# EasyEDA schematic schematic.json
TITLE: Sheet_1; REV: 1.0; Date: 2024-11-03; Sheet: 1/1; Drawn By: ysingh2026; Company: Your Company
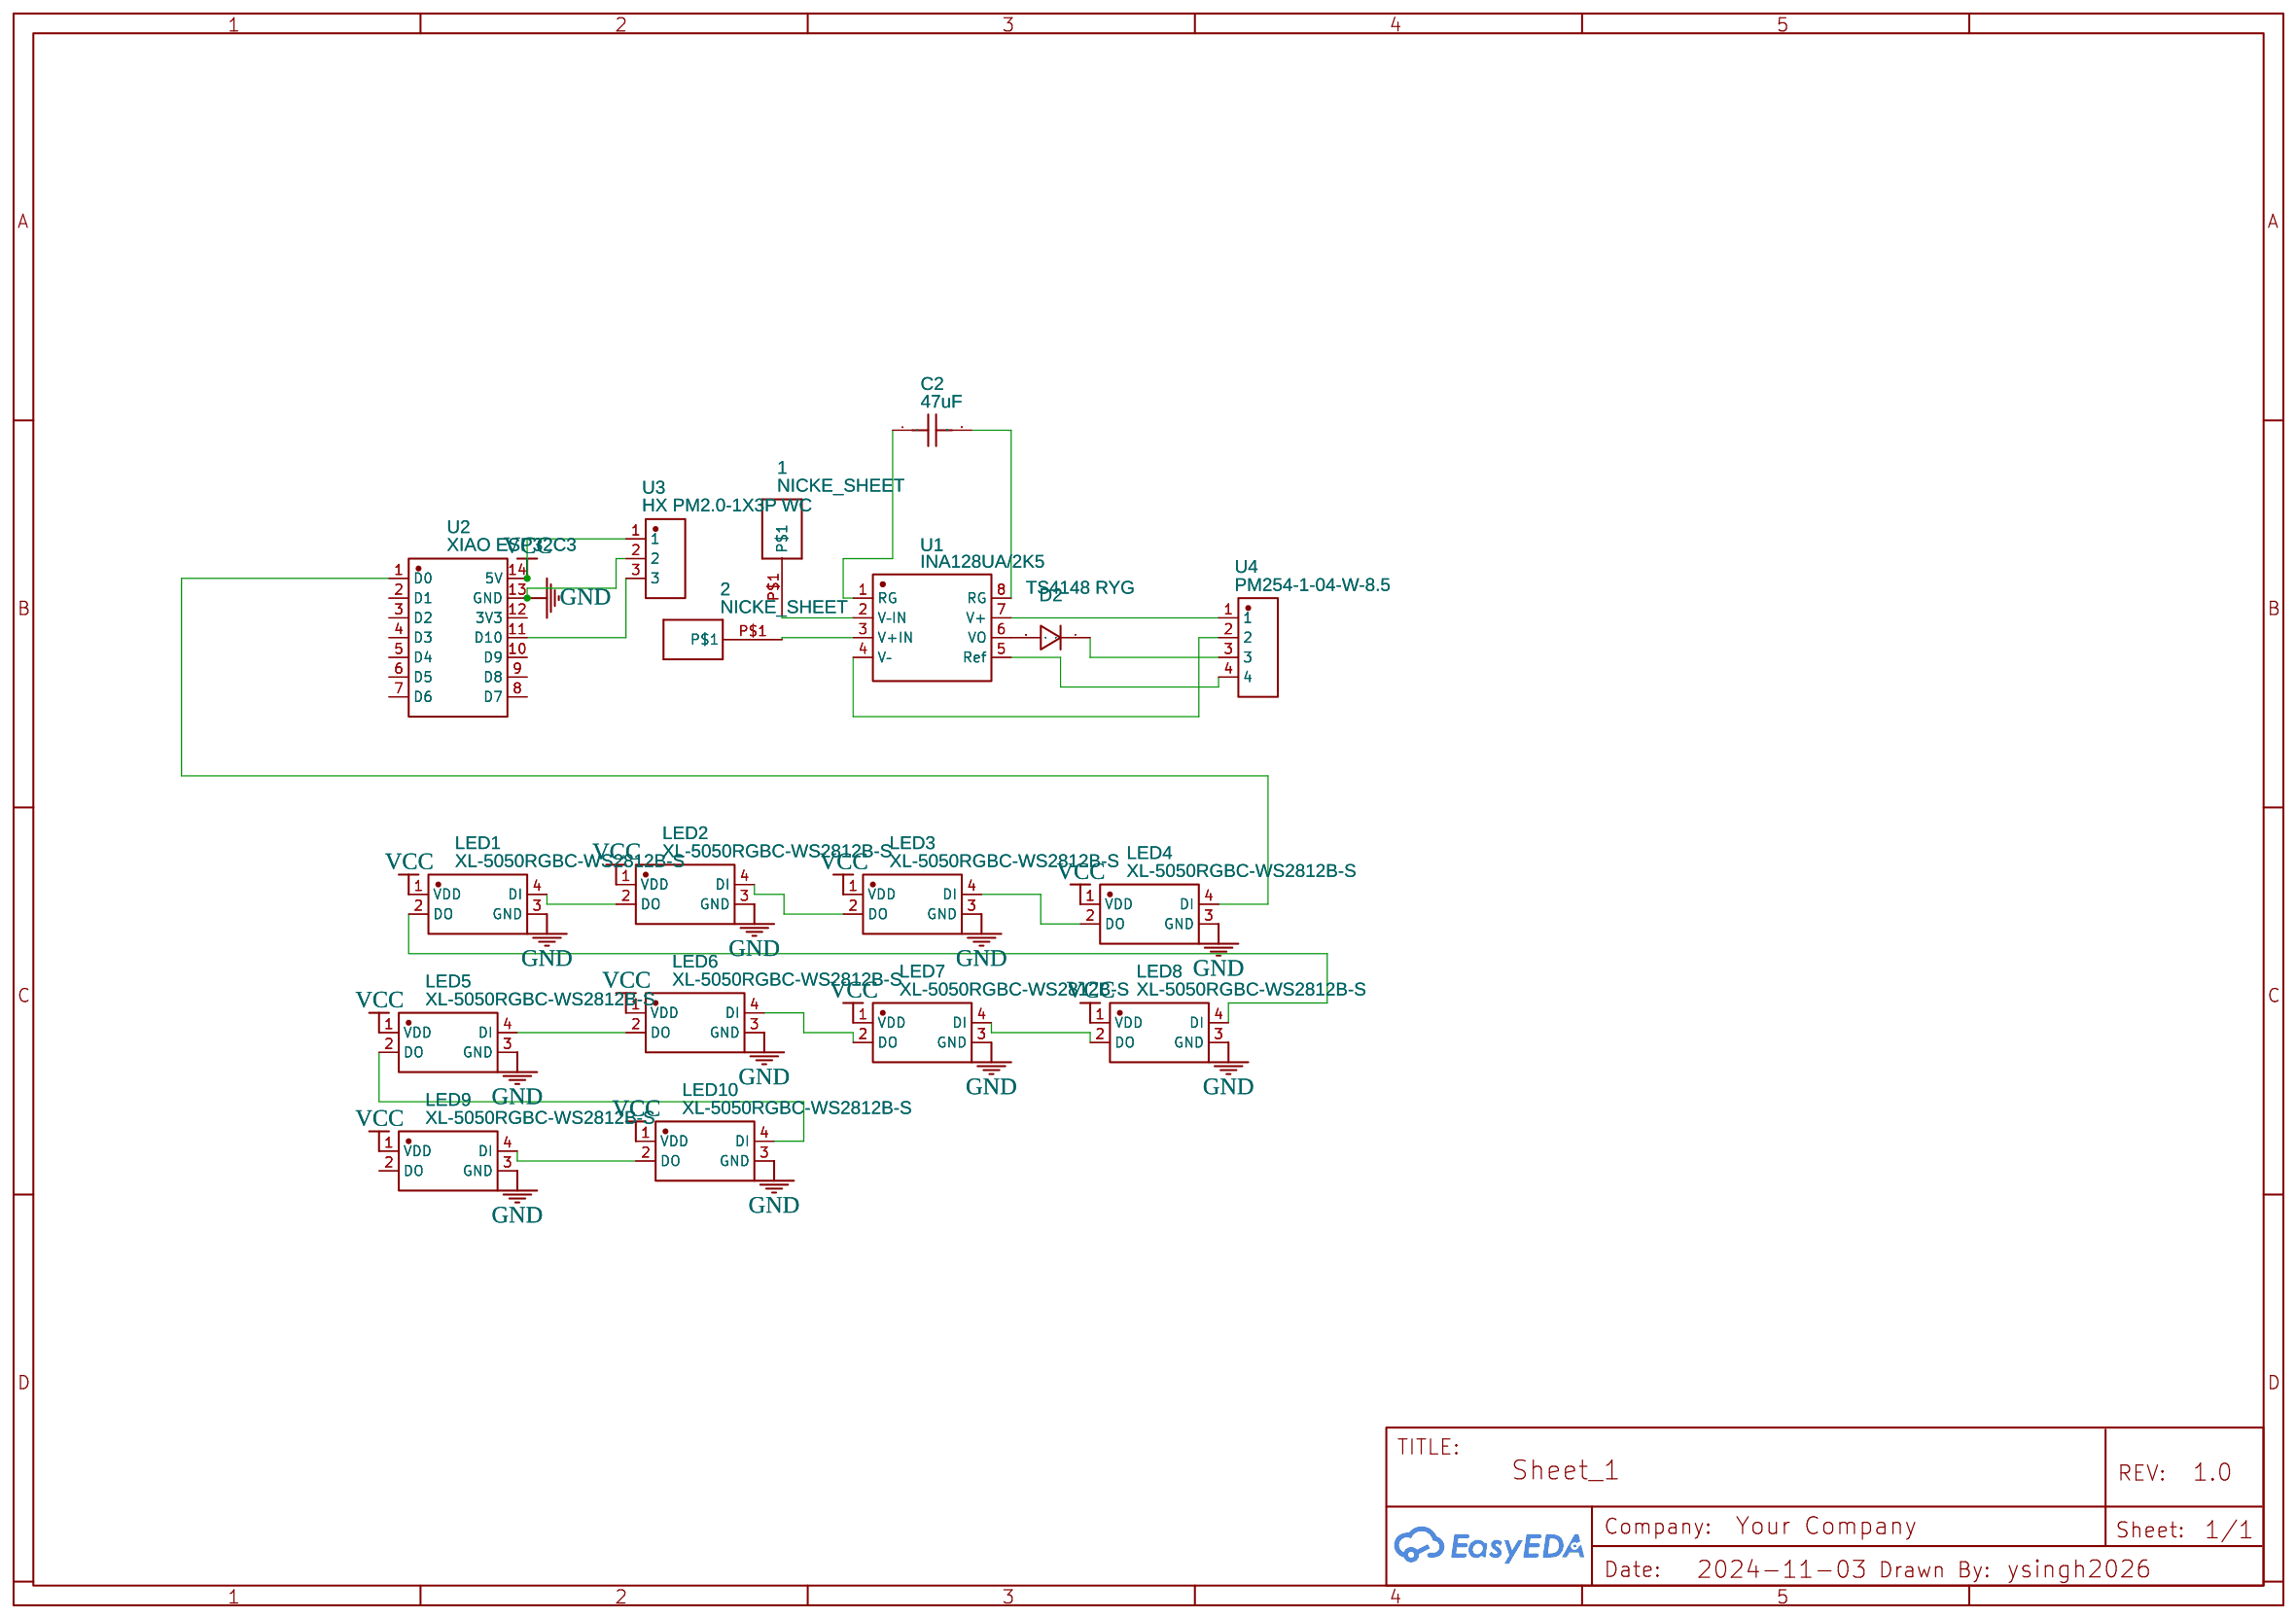
[diagram p0: schematic sheet]

## Parts
1  NICKE_SHEET  [NICKEL_SHEET]
2  NICKE_SHEET  [NICKEL_SHEET]
C2  47uF  [C1210]
D2  TS4148 RYG  [D0805-RD]
LED1  XL-5050RGBC-WS2812B-S  [LED-SMD_4P-L5.0-W5.0-TL-1]
LED2  XL-5050RGBC-WS2812B-S  [LED-SMD_4P-L5.0-W5.0-TL-1]
LED3  XL-5050RGBC-WS2812B-S  [LED-SMD_4P-L5.0-W5.0-TL-1]
LED4  XL-5050RGBC-WS2812B-S  [LED-SMD_4P-L5.0-W5.0-TL-1]
LED5  XL-5050RGBC-WS2812B-S  [LED-SMD_4P-L5.0-W5.0-TL-1]
LED6  XL-5050RGBC-WS2812B-S  [LED-SMD_4P-L5.0-W5.0-TL-1]
LED7  XL-5050RGBC-WS2812B-S  [LED-SMD_4P-L5.0-W5.0-TL-1]
LED8  XL-5050RGBC-WS2812B-S  [LED-SMD_4P-L5.0-W5.0-TL-1]
LED9  XL-5050RGBC-WS2812B-S  [LED-SMD_4P-L5.0-W5.0-TL-1]
LED10  XL-5050RGBC-WS2812B-S  [LED-SMD_4P-L5.0-W5.0-TL-1]
U1  INA128UA/2K5  [SOIC-8_L4.9-W3.9-P1.27-LS6.0-BL]
U2  XIAO ESP32C3  [COMM-SMD_KQ-2801_V106]
U3  HX PM2.0-1X3P WC  [HDR-TH_3P-P2.00-H-F-W4.8]
U4  PM254-1-04-W-8.5  [HDR-TH_4P-P2.54-H-F-W10.0-N]

## Library data of the parts
1 2 = NICKE_SHEET: Contributor: ahmed elqusy
C2 = CS3225X7R476K100NRL: Supplier: LCSC; Supplier Part: C5189825; Manufacturer: SAMWHA(三和); JLCPCB Part Class: Extended Part; Contributor: lcsc
D2 = TS4148 RYG: Supplier: LCSC; Supplier Part: C5341669; Manufacturer: Taiwan Semiconductor(台湾半导体); JLCPCB Part Class: Extended Part; Contributor: lcsc
LED1-LED10 = XL-5050RGBC-WS2812B-S: Supplier: LCSC; Supplier Part: C22461793; Manufacturer: XINGLIGHT(成兴光); Contributor: lcsc; JLCPCB Part Class: Extended Part
U1 = INA128UA/2K5: Supplier: LCSC; Manufacturer: TI(德州仪器); Supplier Part: C22233; JLCPCB Part Class: Extended Part
U2 = XIAO ESP32C3: Supplier: LCSC; Supplier Part: C19189385; Manufacturer: null; JLCPCB Part Class: Extended Part; Contributor: lcsc
U3 = HX PM2.0-1X3P WC: Supplier: LCSC; Supplier Part: C22465677; Manufacturer: hanxia(韩下); Manufacturer Part: HX PM2.0-1x3P WC; JLCPCB Part Class: Extended Part; Contributor: lcsc
U4 = PM254-1-04-W-8.5: Contributor: LCSC; Supplier: LCSC; Supplier Part: C2897386; Manufacturer: HCTL(华灿天禄); JLCPCB Part Class: Extended Part

## Nets
GND: LED1.3(GND) LED2.3(GND) LED3.3(GND) LED4.3(GND) LED5.3(GND) LED6.3(GND) LED7.3(GND) LED8.3(GND) LED9.3(GND) LED10.3(GND) U2.13(GND) U3.2
VCC: LED1.1(VDD) LED2.1(VDD) LED3.1(VDD) LED4.1(VDD) LED5.1(VDD) LED6.1(VDD) LED7.1(VDD) LED8.1(VDD) LED9.1(VDD) LED10.1(VDD) U2.14(5V) U3.1
Net-(1-P$1): 1.P$1 U1.2(V–IN)
Net-(2-P$1): 2.P$1 U1.3(V+IN)
Net-(C2-1): C2.1 U1.1(RG)
Net-(C2-2): C2.2 U1.8(RG)
Net-(D2-1): D2.1 U4.3
Net-(D2-2): D2.2 U1.6(VO)
Net-(LED1-2): LED1.2(DO) LED8.4(DI)
Net-(LED1-4): LED1.4(DI) LED2.2(DO)
Net-(LED2-4): LED2.4(DI) LED3.2(DO)
Net-(LED3-4): LED3.4(DI) LED4.2(DO)
Net-(LED4-4): LED4.4(DI) U2.1(D0)
Net-(LED5-2): LED5.2(DO) LED10.4(DI)
Net-(LED5-4): LED5.4(DI) LED6.2(DO)
Net-(LED6-4): LED6.4(DI) LED7.2(DO)
Net-(LED7-4): LED7.4(DI) LED8.2(DO)
Net-(LED9-4): LED9.4(DI) LED10.2(DO)
Net-(U1-4): U1.4(V–) U4.2
Net-(U1-5): U1.5(Ref) U4.4
Net-(U1-7): U1.7(V+) U4.1
Net-(U2-11): U2.11(D10) U3.3

Not connected (* = marked no-connect by the designer): LED9 2(DO); U2 2(D1) 3(D2) 4(D3) 5(D4) 6(D5) 7(D6) 8(D7) 9(D8) 10(D9) 12(3V3)
